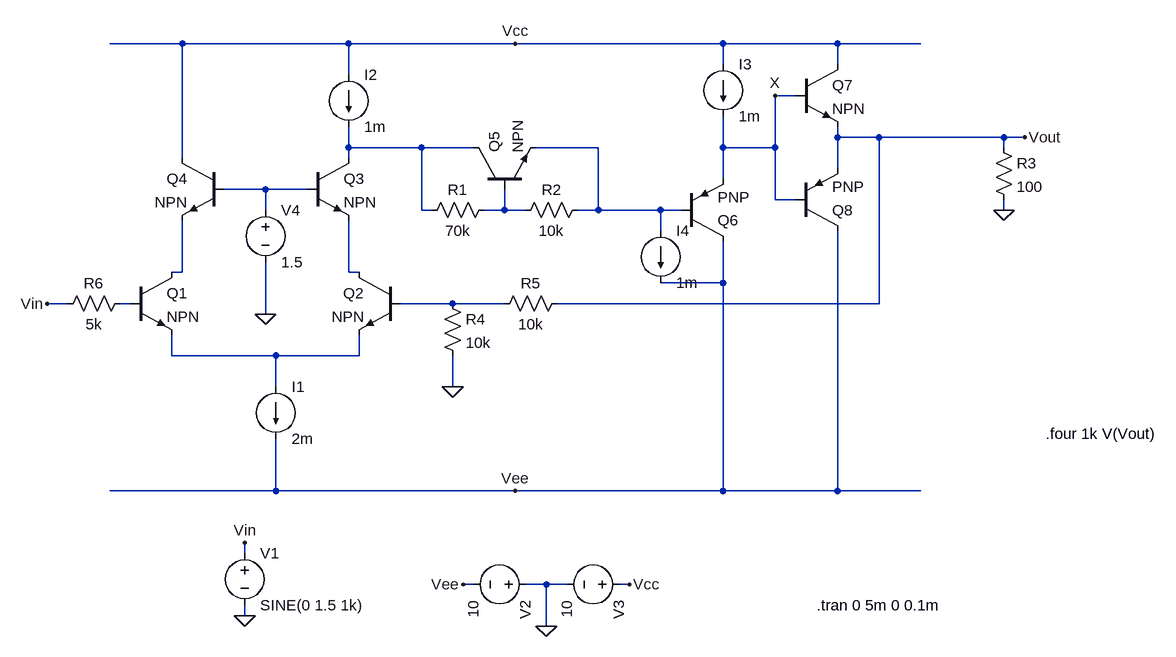
[diagram p0: schematic p1_ better swing.asc]
p1_ better swing.asc, the LTspice schematic file:
Version 4
SHEET 1 1748 680
WIRE 176 -240 64 -240
WIRE 432 -240 176 -240
WIRE 688 -240 432 -240
WIRE 1008 -240 688 -240
WIRE 1184 -240 1008 -240
WIRE 1312 -240 1184 -240
WIRE 1008 -208 1008 -240
WIRE 1184 -208 1184 -240
WIRE 432 -192 432 -240
WIRE 1120 -160 1088 -160
WIRE 1184 -96 1184 -112
WIRE 1248 -96 1184 -96
WIRE 1440 -96 1248 -96
WIRE 1472 -96 1440 -96
WIRE 432 -80 432 -112
WIRE 544 -80 432 -80
WIRE 624 -80 544 -80
WIRE 816 -80 720 -80
WIRE 1008 -80 1008 -128
WIRE 1088 -80 1088 -160
WIRE 1088 -80 1008 -80
WIRE 1440 -80 1440 -96
WIRE 176 -64 176 -240
WIRE 432 -64 432 -80
WIRE 1184 -48 1184 -96
WIRE 1008 -32 1008 -80
WIRE 304 -16 240 -16
WIRE 368 -16 304 -16
WIRE 1088 0 1088 -80
WIRE 1120 0 1088 0
WIRE 304 16 304 -16
WIRE 544 16 544 -80
WIRE 560 16 544 16
WIRE 672 16 672 -16
WIRE 672 16 640 16
WIRE 704 16 672 16
WIRE 816 16 816 -80
WIRE 816 16 784 16
WIRE 912 16 816 16
WIRE 944 16 912 16
WIRE 1440 16 1440 0
WIRE 912 48 912 16
WIRE 176 112 176 32
WIRE 176 112 160 112
WIRE 432 112 432 32
WIRE 448 112 432 112
WIRE 1008 128 1008 64
WIRE 1008 128 912 128
WIRE 0 160 -32 160
WIRE 96 160 80 160
WIRE 592 160 512 160
WIRE 672 160 592 160
WIRE 1248 160 1248 -96
WIRE 1248 160 752 160
WIRE 304 176 304 96
WIRE 160 240 160 208
WIRE 320 240 160 240
WIRE 448 240 448 208
WIRE 448 240 320 240
WIRE 320 288 320 240
WIRE 592 288 592 240
WIRE 320 448 320 368
WIRE 320 448 64 448
WIRE 688 448 320 448
WIRE 1008 448 1008 128
WIRE 1008 448 688 448
WIRE 1184 448 1184 48
WIRE 1184 448 1008 448
WIRE 1312 448 1184 448
WIRE 272 544 272 528
WIRE 624 592 608 592
WIRE 736 592 704 592
WIRE 768 592 736 592
WIRE 864 592 848 592
WIRE 272 640 272 624
WIRE 736 656 736 592
FLAG 1440 16 0
FLAG 592 288 0
FLAG -32 160 Vin
FLAG 1472 -96 Vout
FLAG 736 656 0
FLAG 864 592 Vcc
FLAG 608 592 Vee
FLAG 688 448 Vee
FLAG 688 -240 Vcc
FLAG 272 640 0
FLAG 272 528 Vin
FLAG 304 176 0
FLAG 1088 -160 X
SYMBOL npn 96 112 R0
SYMATTR InstName Q1
SYMBOL npn 512 112 M0
SYMATTR InstName Q2
SYMBOL current 320 288 R0
WINDOW 123 0 0 Left 0
WINDOW 39 0 0 Left 0
SYMATTR InstName I1
SYMATTR Value 2m
SYMBOL npn 368 -64 R0
SYMATTR InstName Q3
SYMBOL npn 240 -64 M0
SYMATTR InstName Q4
SYMBOL current 432 -192 R0
WINDOW 123 0 0 Left 0
WINDOW 39 0 0 Left 0
SYMATTR InstName I2
SYMATTR Value 1m
SYMBOL npn 624 -16 R270
SYMATTR InstName Q5
SYMBOL res 656 0 R90
WINDOW 0 0 56 VBottom 2
WINDOW 3 32 56 VTop 2
SYMATTR InstName R1
SYMATTR Value 70k
SYMBOL res 800 0 R90
WINDOW 0 0 56 VBottom 2
WINDOW 3 32 56 VTop 2
SYMATTR InstName R2
SYMATTR Value 10k
SYMBOL npn 1120 -208 R0
SYMATTR InstName Q7
SYMBOL pnp 1120 48 M180
SYMATTR InstName Q8
SYMBOL res 1424 -96 R0
SYMATTR InstName R3
SYMATTR Value 100
SYMBOL res 576 144 R0
SYMATTR InstName R4
SYMATTR Value 10k
SYMBOL res 768 144 R90
WINDOW 0 0 56 VBottom 2
WINDOW 3 32 56 VTop 2
SYMATTR InstName R5
SYMATTR Value 10k
SYMBOL current 1008 -208 R0
WINDOW 123 0 0 Left 0
WINDOW 39 0 0 Left 0
SYMATTR InstName I3
SYMATTR Value 1m
SYMBOL current 912 48 R0
WINDOW 123 0 0 Left 0
WINDOW 39 0 0 Left 0
SYMATTR InstName I4
SYMATTR Value 1m
SYMBOL res 96 144 R90
WINDOW 0 0 56 VBottom 2
WINDOW 3 32 56 VTop 2
SYMATTR InstName R6
SYMATTR Value 5k
SYMBOL voltage 272 528 R0
WINDOW 123 0 0 Left 0
WINDOW 39 0 0 Left 0
SYMATTR InstName V1
SYMATTR Value SINE(0 1.5 1k)
SYMBOL voltage 720 592 R90
WINDOW 123 0 0 Left 0
WINDOW 39 0 0 Left 0
SYMATTR InstName V2
SYMATTR Value 10
SYMBOL voltage 864 592 R90
WINDOW 123 0 0 Left 0
WINDOW 39 0 0 Left 0
SYMATTR InstName V3
SYMATTR Value 10
SYMBOL pnp 944 64 M180
SYMATTR InstName Q6
SYMBOL voltage 304 0 R0
WINDOW 123 0 0 Left 0
WINDOW 39 0 0 Left 0
SYMATTR InstName V4
SYMATTR Value 1.5
TEXT 1152 624 Left 2 !.tran 0 5m 0 0.1m
TEXT 1504 360 Left 2 !.four 1k V(Vout)

The netlist it stands for:
* p1_ better swing.asc
Q1 N005 N007 N009 0 NPN
Q2 N006 N008 N009 0 NPN
I1 N009 Vee 2m
Q3 N001 N003 N006 0 NPN
Q4 Vcc N003 N005 0 NPN
I2 Vcc N001 1m
Q5 N001 N004 N002 0 NPN
R1 N004 N001 70k
R2 N002 N004 10k
Q7 Vcc X Vout 0 NPN
Q8 Vee X Vout 0 PNP
R3 Vout 0 100
R4 N008 0 10k
R5 Vout N008 10k
I3 Vcc X 1m
I4 N002 Vee 1m
R6 N007 Vin 5k
V1 Vin 0 SINE(0 1.5 1k)
V2 0 Vee 10
V3 Vcc 0 10
Q6 Vee N002 X 0 PNP
V4 N003 0 1.5
.model NPN NPN
.model PNP PNP
.lib standard.bjt
.tran 0 5m 0 0.1m
.four 1k V(Vout)
.backanno
.end